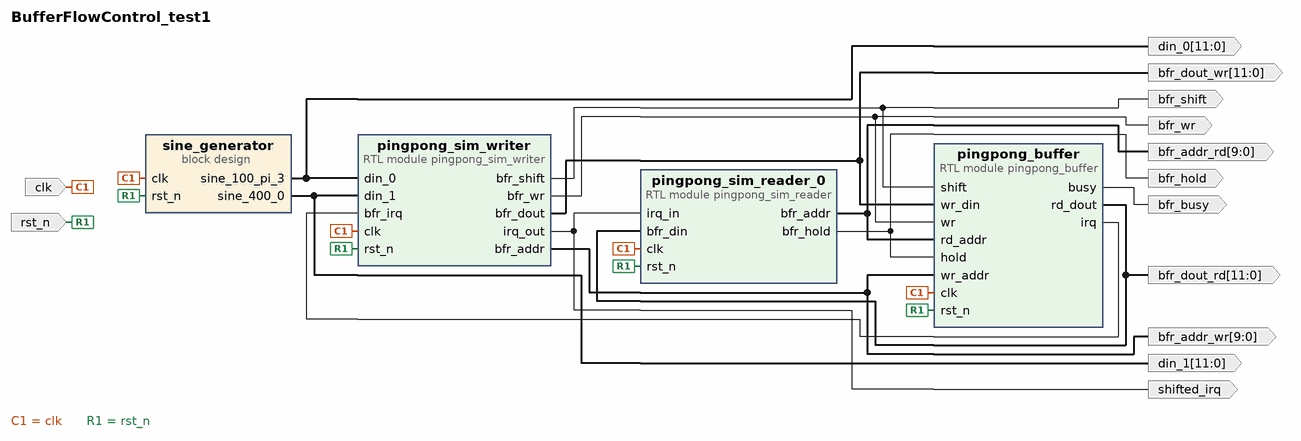
[diagram p0: block diagram of the top level]
# Vivado block design BufferFlowControl_test1, xczu3eg-sbva484-1-i, Vivado 2020.2
create_bd_design BufferFlowControl_test1

create_bd_port -dir I -type clk clk
create_bd_port -dir I -type rst rst_n
create_bd_port -dir O -from 11 -to 0 din_0
create_bd_port -dir O -from 11 -to 0 din_1
create_bd_port -dir O -from 11 -to 0 bfr_dout_wr
create_bd_port -dir O -from 9 -to 0 bfr_addr_wr
create_bd_port -dir O bfr_wr
create_bd_port -dir O bfr_shift
create_bd_port -dir O bfr_busy
create_bd_port -dir O -from 9 -to 0 bfr_addr_rd
create_bd_port -dir O bfr_hold
create_bd_port -dir O -from 11 -to 0 bfr_dout_rd
create_bd_port -dir O shifted_irq

create_bd_cell -type container -reference sine_generator sine_generator
set_property -dict [list \
  CONFIG.ACTIVE_SIM_BD sine_generator.bd \
  CONFIG.ACTIVE_SYNTH_BD sine_generator.bd \
  CONFIG.ENABLE_DFX 0 \
  CONFIG.LIST_SIM_BD sine_generator.bd \
  CONFIG.LIST_SYNTH_BD sine_generator.bd \
  CONFIG.LOCK_PROPAGATE 0 \
  CONFIG.TRAINING_MODULE sine_generator.bd \
] [get_bd_cells sine_generator]
create_bd_cell -type module -reference pingpong_sim_writer pingpong_sim_writer
create_bd_cell -type module -reference pingpong_sim_reader pingpong_sim_reader_0
create_bd_cell -type module -reference pingpong_buffer pingpong_buffer
set_property -dict {CONFIG.addr_width 10 CONFIG.word_width 12} [get_bd_cells pingpong_buffer]

# ---- connections ----

connect_bd_net -net clk_0_1 [get_bd_ports clk] \
  [get_bd_pins sine_generator/clk] [get_bd_pins pingpong_sim_writer/clk] [get_bd_pins pingpong_sim_reader_0/clk] \
  [get_bd_pins pingpong_buffer/clk]
connect_bd_net -net rst_n_0_1 [get_bd_ports rst_n] \
  [get_bd_pins sine_generator/rst_n] [get_bd_pins pingpong_sim_writer/rst_n] [get_bd_pins pingpong_sim_reader_0/rst_n] \
  [get_bd_pins pingpong_buffer/rst_n]
connect_bd_net [get_bd_pins pingpong_buffer/irq] [get_bd_pins pingpong_sim_writer/bfr_irq]
connect_bd_net [get_bd_pins sine_generator/sine_100_pi_3] [get_bd_ports din_0] [get_bd_pins pingpong_sim_writer/din_0]
connect_bd_net [get_bd_pins sine_generator/sine_400_0] [get_bd_ports din_1] [get_bd_pins pingpong_sim_writer/din_1]
connect_bd_net [get_bd_pins pingpong_sim_writer/bfr_wr] [get_bd_ports bfr_wr] [get_bd_pins pingpong_buffer/wr]
connect_bd_net [get_bd_pins pingpong_sim_writer/bfr_shift] [get_bd_ports bfr_shift] [get_bd_pins pingpong_buffer/shift]
connect_bd_net [get_bd_pins pingpong_sim_writer/bfr_dout] [get_bd_ports bfr_dout_wr] [get_bd_pins pingpong_buffer/wr_din]
connect_bd_net [get_bd_pins pingpong_sim_writer/bfr_addr] [get_bd_ports bfr_addr_wr] [get_bd_pins pingpong_buffer/wr_addr]
connect_bd_net [get_bd_pins pingpong_buffer/rd_dout] [get_bd_ports bfr_dout_rd] [get_bd_pins pingpong_sim_reader_0/bfr_din]
connect_bd_net [get_bd_pins pingpong_sim_writer/irq_out] [get_bd_ports shifted_irq] [get_bd_pins pingpong_sim_reader_0/irq_in]
connect_bd_net [get_bd_pins pingpong_sim_reader_0/bfr_hold] [get_bd_ports bfr_hold] [get_bd_pins pingpong_buffer/hold]
connect_bd_net [get_bd_pins pingpong_sim_reader_0/bfr_addr] [get_bd_ports bfr_addr_rd] [get_bd_pins pingpong_buffer/rd_addr]
connect_bd_net [get_bd_pins pingpong_buffer/busy] [get_bd_ports bfr_busy]

validate_bd_design
save_bd_design
